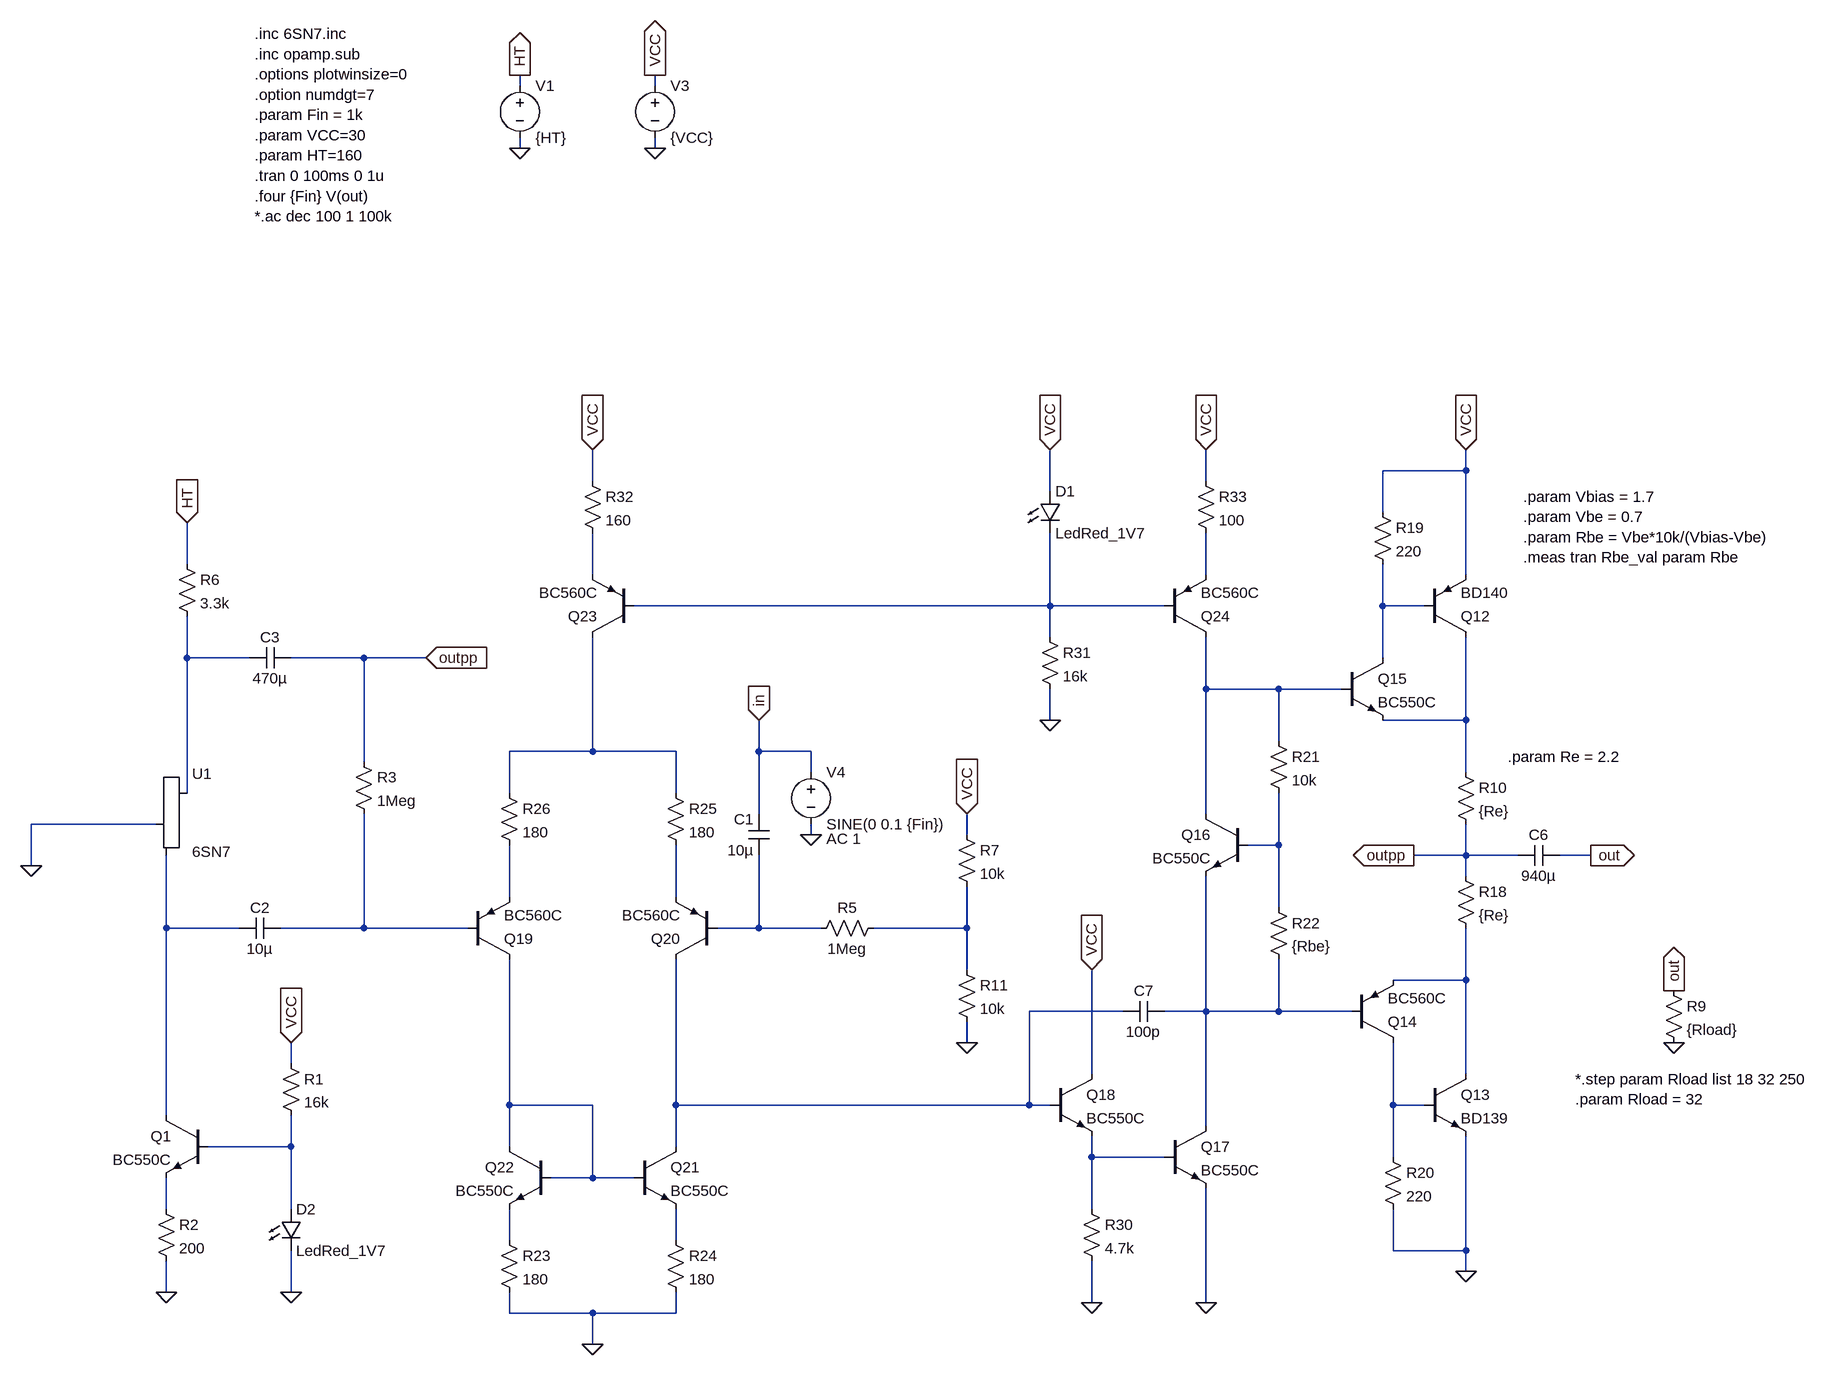
[diagram p0: schematic Super triode discrete op amp.asc]
Super triode discrete op amp.asc, the LTspice schematic file:
Version 4
SHEET 1 3688 1952
WIRE -368 0 -368 -16
WIRE -160 0 -160 -16
WIRE -368 96 -368 80
WIRE -160 96 -160 80
WIRE 1088 592 1088 560
WIRE 1088 592 960 592
WIRE -256 608 -256 560
WIRE 688 608 688 560
WIRE 448 624 448 560
WIRE 960 656 960 592
WIRE -880 736 -880 672
WIRE -256 752 -256 688
WIRE 688 752 688 688
WIRE 1088 752 1088 592
WIRE 448 800 448 688
WIRE 448 800 -192 800
WIRE 624 800 448 800
WIRE 960 800 960 736
WIRE 1024 800 960 800
WIRE 448 848 448 800
WIRE -880 880 -880 816
WIRE -784 880 -880 880
WIRE -608 880 -720 880
WIRE -512 880 -608 880
WIRE 960 880 960 800
WIRE 688 928 688 848
WIRE 800 928 688 928
WIRE 896 928 800 928
WIRE 448 976 448 928
WIRE 1088 976 1088 848
WIRE 1088 976 960 976
WIRE 800 1008 800 928
WIRE -256 1024 -256 848
WIRE -256 1024 -384 1024
WIRE -128 1024 -256 1024
WIRE 0 1024 0 976
WIRE 80 1024 0 1024
WIRE -608 1040 -608 880
WIRE 80 1056 80 1024
WIRE 1088 1056 1088 976
WIRE -880 1088 -880 880
WIRE -384 1088 -384 1024
WIRE -128 1088 -128 1024
WIRE 0 1120 0 1024
WIRE 688 1120 688 928
WIRE -928 1136 -1120 1136
WIRE 80 1152 80 1136
WIRE 320 1152 320 1120
WIRE 800 1168 800 1088
WIRE 800 1168 752 1168
WIRE 1088 1184 1088 1136
WIRE 1088 1184 1008 1184
WIRE 1168 1184 1088 1184
WIRE 1280 1184 1232 1184
WIRE -1120 1200 -1120 1136
WIRE 1088 1216 1088 1184
WIRE -384 1248 -384 1168
WIRE -128 1248 -128 1168
WIRE 800 1264 800 1168
WIRE -912 1296 -912 1184
WIRE -800 1296 -912 1296
WIRE -608 1296 -608 1120
WIRE -608 1296 -736 1296
WIRE -448 1296 -608 1296
WIRE 0 1296 0 1184
WIRE 0 1296 -64 1296
WIRE 96 1296 0 1296
WIRE 320 1296 320 1232
WIRE 320 1296 176 1296
WIRE 320 1360 320 1296
WIRE 1088 1376 1088 1296
WIRE 1088 1376 976 1376
WIRE 560 1424 416 1424
WIRE 688 1424 688 1216
WIRE 688 1424 624 1424
WIRE 800 1424 800 1344
WIRE 800 1424 688 1424
WIRE 912 1424 800 1424
WIRE 320 1472 320 1440
WIRE -720 1504 -720 1472
WIRE 512 1520 512 1360
WIRE 1088 1520 1088 1376
WIRE -384 1568 -384 1344
WIRE -256 1568 -384 1568
WIRE -128 1568 -128 1344
WIRE 416 1568 416 1424
WIRE 416 1568 -128 1568
WIRE 448 1568 416 1568
WIRE 976 1568 976 1472
WIRE 1024 1568 976 1568
WIRE -912 1584 -912 1296
WIRE 688 1600 688 1424
WIRE -720 1632 -720 1584
WIRE -720 1632 -848 1632
WIRE -384 1632 -384 1568
WIRE -128 1632 -128 1568
WIRE 512 1648 512 1616
WIRE 624 1648 512 1648
WIRE 976 1648 976 1568
WIRE -256 1680 -256 1568
WIRE -256 1680 -320 1680
WIRE -192 1680 -256 1680
WIRE -912 1728 -912 1680
WIRE -720 1728 -720 1632
WIRE 512 1728 512 1648
WIRE -384 1776 -384 1728
WIRE -128 1776 -128 1728
WIRE 976 1792 976 1728
WIRE 1088 1792 1088 1616
WIRE 1088 1792 976 1792
WIRE 1088 1824 1088 1792
WIRE -912 1856 -912 1808
WIRE -720 1856 -720 1792
WIRE 512 1872 512 1808
WIRE 688 1872 688 1696
WIRE -384 1888 -384 1856
WIRE -256 1888 -384 1888
WIRE -128 1888 -128 1856
WIRE -128 1888 -256 1888
WIRE -256 1936 -256 1888
FLAG -368 96 0
FLAG -368 -16 HT
IOPIN -368 -16 Out
FLAG -880 672 HT
IOPIN -880 672 In
FLAG -160 96 0
FLAG -160 -16 VCC
IOPIN -160 -16 Out
FLAG -512 880 outpp
IOPIN -512 880 In
FLAG -1120 1200 0
FLAG 1088 560 VCC
IOPIN 1088 560 In
FLAG 1280 1184 out
IOPIN 1280 1184 Out
FLAG 1408 1392 out
IOPIN 1408 1392 Out
FLAG 1408 1472 0
FLAG 1088 1824 0
FLAG 1008 1184 outpp
IOPIN 1008 1184 Out
FLAG 688 1872 0
FLAG 688 560 VCC
IOPIN 688 560 In
FLAG 512 1360 VCC
IOPIN 512 1360 In
FLAG -256 560 VCC
IOPIN -256 560 In
FLAG -256 1936 0
FLAG 512 1872 0
FLAG 448 560 VCC
IOPIN 448 560 In
FLAG 448 976 0
FLAG -720 1472 VCC
IOPIN -720 1472 In
FLAG -720 1856 0
FLAG -912 1856 0
FLAG 80 1152 0
FLAG 0 976 in
IOPIN 0 976 In
FLAG 320 1120 VCC
IOPIN 320 1120 In
FLAG 320 1472 0
SYMBOL voltage -368 -16 R0
SYMATTR InstName V1
SYMATTR Value {HT}
SYMBOL Misc/triode -880 1136 R0
SYMATTR InstName U1
SYMATTR Value 6SN7
SYMBOL res -896 720 R0
SYMATTR InstName R6
SYMATTR Value 3.3k
SYMBOL voltage -160 -16 R0
SYMATTR InstName V3
SYMATTR Value {VCC}
SYMBOL cap -720 864 R90
WINDOW 0 0 32 VBottom 2
WINDOW 3 32 32 VTop 2
SYMATTR InstName C3
SYMATTR Value 470µ
SYMBOL cap -736 1280 R90
WINDOW 0 0 32 VBottom 2
WINDOW 3 32 32 VTop 2
SYMATTR InstName C2
SYMATTR Value 10µ
SYMBOL res -624 1024 R0
SYMATTR InstName R3
SYMATTR Value 1Meg
SYMBOL res 1392 1376 R0
SYMATTR InstName R9
SYMATTR Value {Rload}
SYMBOL res 1072 1040 R0
SYMATTR InstName R10
SYMATTR Value {Re}
SYMBOL res 1072 1200 R0
SYMATTR InstName R18
SYMATTR Value {Re}
SYMBOL pnp 1024 848 M180
SYMATTR InstName Q12
SYMATTR Value BD140
SYMBOL npn 1024 1520 R0
SYMATTR InstName Q13
SYMATTR Value BD139
SYMBOL cap 1232 1168 R90
WINDOW 0 0 32 VBottom 2
WINDOW 3 32 32 VTop 2
SYMATTR InstName C6
SYMATTR Value 940µ
SYMBOL pnp 912 1472 M180
SYMATTR InstName Q14
SYMATTR Value BC560C
SYMBOL npn 896 880 R0
SYMATTR InstName Q15
SYMATTR Value BC550C
SYMBOL res 944 640 R0
SYMATTR InstName R19
SYMATTR Value 220
SYMBOL res 960 1632 R0
SYMATTR InstName R20
SYMATTR Value 220
SYMBOL npn 752 1120 M0
SYMATTR InstName Q16
SYMATTR Value BC550C
SYMBOL res 784 992 R0
SYMATTR InstName R21
SYMATTR Value 10k
SYMBOL res 784 1248 R0
SYMATTR InstName R22
SYMATTR Value {Rbe}
SYMBOL npn 624 1600 R0
SYMATTR InstName Q17
SYMATTR Value BC550C
SYMBOL cap 624 1408 R90
WINDOW 0 0 32 VBottom 2
WINDOW 3 32 32 VTop 2
SYMATTR InstName C7
SYMATTR Value 100p
SYMBOL npn 448 1520 R0
SYMATTR InstName Q18
SYMATTR Value BC550C
SYMBOL pnp -448 1344 M180
SYMATTR InstName Q19
SYMATTR Value BC560C
SYMBOL pnp -64 1344 R180
SYMATTR InstName Q20
SYMATTR Value BC560C
SYMBOL res -400 1760 R0
SYMATTR InstName R23
SYMATTR Value 180
SYMBOL res -144 1760 R0
SYMATTR InstName R24
SYMATTR Value 180
SYMBOL npn -192 1632 R0
SYMATTR InstName Q21
SYMATTR Value BC550C
SYMBOL npn -320 1632 M0
SYMATTR InstName Q22
SYMATTR Value BC550C
SYMBOL res -144 1072 R0
SYMATTR InstName R25
SYMATTR Value 180
SYMBOL res -400 1072 R0
SYMATTR InstName R26
SYMATTR Value 180
SYMBOL res 496 1712 R0
SYMATTR InstName R30
SYMATTR Value 4.7k
SYMBOL LED 432 624 R0
SYMATTR InstName D1
SYMATTR Value LedRed_1V7
SYMBOL res 432 832 R0
SYMATTR InstName R31
SYMATTR Value 16k
SYMBOL pnp -192 848 R180
SYMATTR InstName Q23
SYMATTR Value BC560C
SYMBOL res -272 592 R0
SYMATTR InstName R32
SYMATTR Value 160
SYMBOL pnp 624 848 M180
SYMATTR InstName Q24
SYMATTR Value BC560C
SYMBOL res 672 592 R0
SYMATTR InstName R33
SYMATTR Value 100
SYMBOL LED -736 1728 R0
SYMATTR InstName D2
SYMATTR Value LedRed_1V7
SYMBOL res -736 1488 R0
SYMATTR InstName R1
SYMATTR Value 16k
SYMBOL npn -848 1584 M0
SYMATTR InstName Q1
SYMATTR Value BC550C
SYMBOL res -928 1712 R0
SYMATTR InstName R2
SYMATTR Value 200
SYMBOL voltage 80 1040 R0
WINDOW 123 24 118 Left 2
SYMATTR Value2 AC 1
SYMATTR InstName V4
SYMATTR Value SINE(0 0.1 {Fin})
SYMBOL cap 16 1184 R180
WINDOW 0 24 56 Left 2
WINDOW 3 24 8 Left 2
SYMATTR InstName C1
SYMATTR Value 10µ
SYMBOL res 192 1280 R90
WINDOW 0 0 56 VBottom 2
WINDOW 3 32 56 VTop 2
SYMATTR InstName R5
SYMATTR Value 1Meg
SYMBOL res 304 1136 R0
SYMATTR InstName R7
SYMATTR Value 10k
SYMBOL res 304 1344 R0
SYMATTR InstName R11
SYMATTR Value 10k
TEXT -776 -80 Left 2 !.inc 6SN7.inc\n.inc opamp.sub\n.options plotwinsize=0\n.option numdgt=7\n.param Fin = 1k\n.param VCC=30\n.param HT=160\n.tran 0 100ms 0 1u\n.four {Fin} V(out)\n*.ac dec 100 1 100k
TEXT 1256 1528 Left 2 !*.step param Rload list 18 32 250\n.param Rload = 32
TEXT 1176 632 Left 2 !.param Vbias = 1.7\n.param Vbe = 0.7\n.param Rbe = Vbe*10k/(Vbias-Vbe)\n.meas tran Rbe_val param Rbe
TEXT 1152 1032 Left 2 !.param Re = 2.2

The netlist it stands for:
* Super triode discrete op amp.asc
V1 HT 0 {HT}
XU1 N005 0 N012 6SN7
R6 HT N005 3.3k
V3 VCC 0 {VCC}
C3 outpp N005 470µ
C2 N013 N012 10µ
R3 outpp N013 1Meg
R9 out 0 {Rload}
R10 N007 outpp {Re}
R18 outpp N016 {Re}
Q12 N007 N004 VCC 0 BD140
Q13 N016 N020 0 0 BD139
C6 out outpp 940µ
Q14 N020 N018 N016 0 BC560C
Q15 N004 N006 N007 0 BC550C
R19 VCC N004 220
R20 N020 0 220
Q16 N006 N009 N018 0 BC550C
R21 N006 N009 10k
R22 N009 N018 {Rbe}
Q17 N018 N022 0 0 BC550C
C7 N018 N017 100p
Q18 VCC N017 N022 0 BC550C
Q19 N019 N013 N010 0 BC560C
Q20 N017 N014 N011 0 BC560C
R23 N024 0 180
R24 N025 0 180
Q21 N017 N019 N025 0 BC550C
Q22 N019 N019 N024 0 BC550C
R25 N008 N011 180
R26 N008 N010 180
R30 N022 0 4.7k
D1 VCC N003 LedRed_1V7
R31 N003 0 16k
Q23 N008 N003 N001 0 BC560C
R32 VCC N001 160
Q24 N006 N003 N002 0 BC560C
R33 VCC N002 100
D2 N021 0 LedRed_1V7
R1 VCC N021 16k
Q1 N012 N021 N023 0 BC550C
R2 N023 0 200
V4 in 0 SINE(0 0.1 {Fin}) AC 1
C1 N014 in 10µ
R5 N015 N014 1Meg
R7 VCC N015 10k
R11 N015 0 10k
.model D D
.lib standard.dio
.model NPN NPN
.model PNP PNP
.lib standard.bjt
.inc 6SN7.inc
.inc opamp.sub
.options plotwinsize=0
.option numdgt=7
.param Fin = 1k
.param VCC=30
.param HT=160
.tran 0 100ms 0 1u
.four {Fin} V(out)
*.ac dec 100 1 100k
*.step param Rload list 18 32 250
.param Rload = 32
.param Vbias = 1.7
.param Vbe = 0.7
.param Rbe = Vbe*10k/(Vbias-Vbe)
.meas tran Rbe_val param Rbe
.param Re = 2.2
.backanno
.end